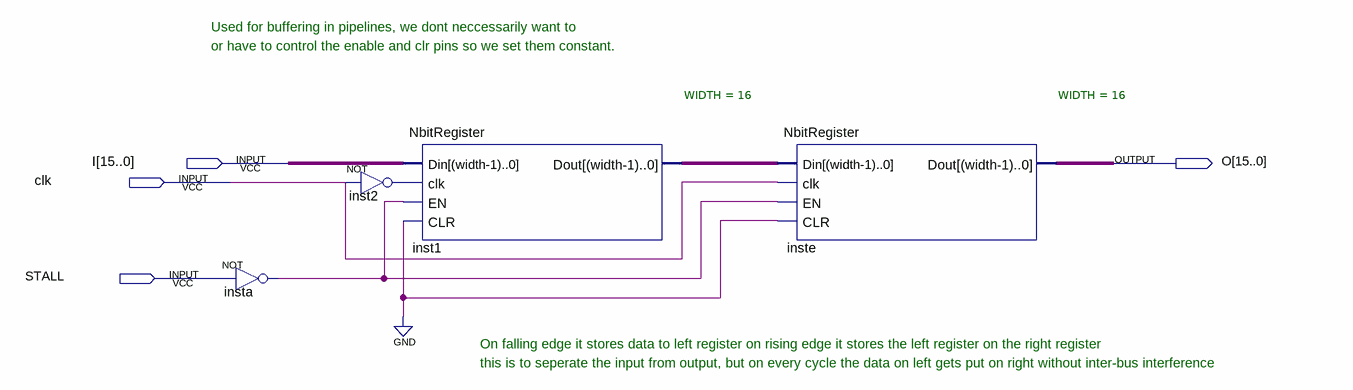
[diagram p0: schematic sheet]
// Quartus schematic 16bitR.bdf as structural Verilog: 4 symbols, 4 pins
module \16bitR  (
  input  [15:0] I,
  input  clk,
  input  STALL,
  output [15:0] O
);

  wire inst2_out, insta_out;
  wire [15:0] inst1_dout;

  not insta (insta_out, STALL);
  not inst2 (inst2_out, clk);
  NbitRegister #(.WIDTH(16)) inst1 (.Din(I), .clk(inst2_out), .EN(insta_out), .CLR(1'b0), .Dout(inst1_dout));
  NbitRegister #(.WIDTH(16)) inste (.Din(inst1_dout), .clk(clk), .EN(insta_out), .CLR(1'b0), .Dout(O));

  // Notes on the sheet:
  //   Used for buffering in pipelines, we dont neccessarily want to
  //   or have to control the enable and clr pins so we set them constant.
  //   On falling edge it stores data to left register on rising edge it stores the left register on the right register
  //   this is to seperate the input from output, but on every cycle the data on left gets put on right without inter-bus interference
endmodule
